# EAGLE design pic32 (EAGLE 5.12)
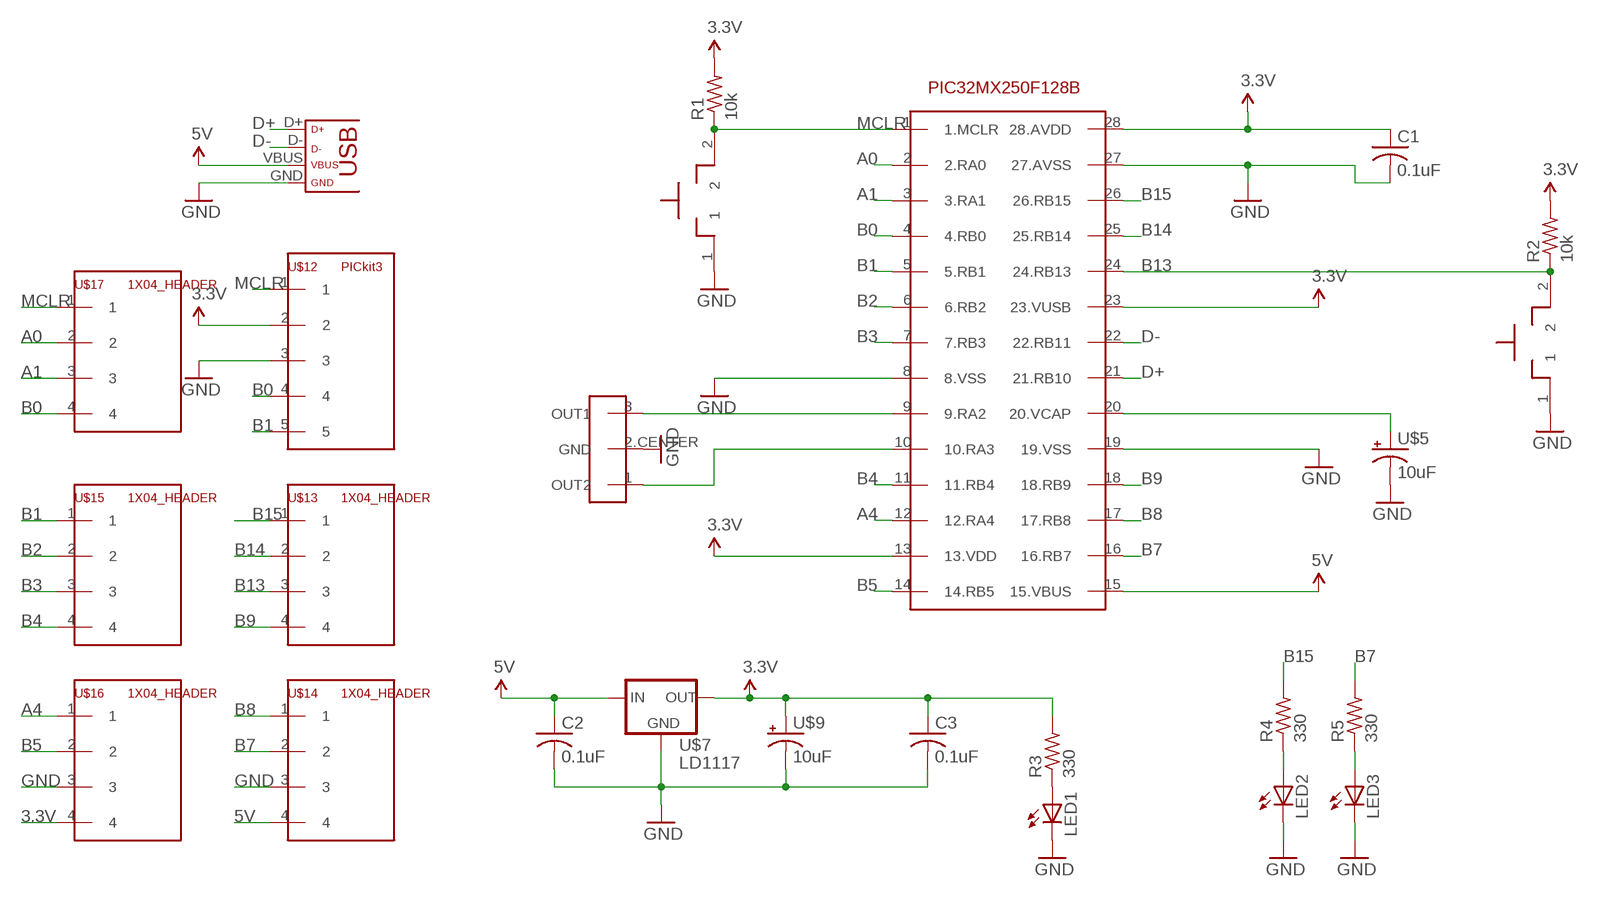
[diagram p0: schematic, sheet 1]

## Parts
8MHZ  RESONATORRESONATOR  [RESONATOR]
C1  0.1uF  C-US025-025X050  [C025-025X050]
C2  0.1uF  C-US025-025X050  [C025-025X050]
C3  0.1uF  C-US025-025X050  [C025-025X050]
CLEAR  BUTTONBUTTON  [0204/5]
LED1  LED3MM  [LED3MM]
LED2  LED3MM  [LED3MM]
LED3  LED3MM  [LED3MM]
R1  10k  R-US_0204/7  [0204/7]
R2  10k  R-US_0204/7  [0204/7]
R3  330  R-US_0204/7  [0204/7]
R4  330  R-US_0204/7  [0204/7]
R5  330  R-US_0204/7  [0204/7]
U$1  PIC32MX250F128B  PIC32DILPIC32MX250F128B  [DIL28-4]
U$5  10uF  CAP_POL  [CAP_POL_D]
U$7  LD1117  [TO220]
U$9  10uF  CAP_POL  [CAP_POL_D]
U$10  USB  [USB-MINIB]
U$12  PICkit3  1X05_HEADER  [1X05]
U$13  1X04_HEADER  [1X04]
U$14  1X04_HEADER  [1X04]
U$15  1X04_HEADER  [1X04]
U$16  1X04_HEADER  [1X04]
U$17  1X04_HEADER  [1X04]
USER  BUTTONBUTTON  [0204/5]

## Nets
3.3V: C1.1 C3.1 R1.2 R2.2 R3.2 U$1.13(13.VDD) U$1.23(23.VUSB) U$1.28(28.AVDD) U$7.2(OUT) U$9.1(+) U$12.2 U$16.4
5V: C2.1 U$1.15(15.VBUS) U$7.3(IN) U$10.VBUS U$14.4
A0: U$1.2(2.RA0) U$17.2
A1: U$1.3(3.RA1) U$17.3
A4: U$1.12(12.RA4) U$16.1
B0: U$1.4(4.RB0) U$12.4 U$17.4
B1: U$1.5(5.RB1) U$12.5 U$15.1
B2: U$1.6(6.RB2) U$15.2
B3: U$1.7(7.RB3) U$15.3
B4: U$1.11(11.RB4) U$15.4
B5: U$1.14(14.RB5) U$16.2
B7: R5.2 U$1.16(16.RB7) U$14.2
B8: U$1.17(17.RB8) U$14.1
B9: U$1.18(18.RB9) U$13.4
B13: R2.1 U$1.24(24.RB13) U$13.3 USER.2
B14: U$1.25(25.RB14) U$13.2
B15: R4.2 U$1.26(26.RB15) U$13.1
D+: U$1.21(21.RB10) U$10.D+
D-: U$1.22(22.RB11) U$10.D-
GND: 8MHZ.2.CENTER(GND) C1.2 C2.2 C3.2 CLEAR.1 LED1.K(C) LED2.K(C) LED3.K(C) U$1.8(8.VSS) U$1.19(19.VSS) U$1.27(27.AVSS) U$5.2(-) U$7.1(GND) U$9.2(-) U$10.GND U$12.3 U$14.3 U$16.3 USER.1
MCLR: CLEAR.2 R1.1 U$1.1(1.MCLR) U$12.1 U$17.1
N$2: 8MHZ.3(OUT1) U$1.9(9.RA2)
N$3: 8MHZ.1(OUT2) U$1.10(10.RA3)
N$4: U$1.20(20.VCAP) U$5.1(+)
N$8: LED1.A R3.1
N$9: LED2.A R4.1
N$10: LED3.A R5.1

## Library data of the parts
8MHZ = ME433:RESONATOR
C1-C3 = ME433:C-US: CAPACITOR, American symbol
CLEAR USER = ME433:BUTTON
LED1-LED3 = ME433:LED: LED OSRAM: - CHIPLED LG R971, LG N971, LY N971, LG Q971, LY Q971, LO R971, LY R971 LH N974, LH R974 LS Q976, LO Q976, LY Q976 LO Q996 - Hyper CHIPLED LW Q18S LB Q993, LB Q99A, LB R99A - SideLED LS A670, LO A670, LY A670, LG A670, LP A670 LB A673, LV A673, LT A673, LW A673 LH A674 LY A675 LS A676, LA A676, LO A676, LY A676, LW A676 LS A679, LY A679, LG A679 - Hyper Micro SIDELED® LS Y876, LA Y876, LO Y876, LY Y876 LT Y87S - SmartLED LW L88C, LW L88S LB L89C, LB L89S, LG L890 LS L89K, LO L89K, LY L89K LS L896, LA L896, LO L896, LY L896 - TOPLED LS T670, LO T670, LY T670, LG T670, LP T670 LSG T670, LSP T670, LSY T670, LOP T670, LYG T670 LG T671, LOG T671, LSG T671 LB T673, LV T673, LT T673, LW T673 LH T674 LS T676, LA T676, LO T676, LY T676, LB T676, LH T676, LSB T676, LW T676 LB T67C, LV T67C, LT T67C, LS T67K, LO T67K, LY T67K, LW E67C LS E67B, LA E67B, LO E67B, LY E67B, LB E67C, LV E67C, LT E67C LW T67C LS T679, LY T679, LG T679 LS T770, LO T770, LY T770, LG T770, LP T770 LB T773, LV T773, LT T773, LW T773 LH T774 LS E675, LA E675, LY E675, LS T675 LS T776, LA T776, LO T776, LY T776, LB T776 LHGB T686 LT T68C, LB T68C - Hyper Mini TOPLED® LB M676 - Mini TOPLED Santana® LG M470 LS M47K, LO M47K, LY M47K Source: http://www.osram.convergy.de LUXEON: - LUMILED® LXK2-PW12-R00, LXK2-PW12-S00, LXK2-PW14-U00, LXK2-PW14-V00 LXK2-PM12-R00, LXK2-PM12-S00, LXK2-PM14-U00 LXK2-PE12-Q00, LXK2-PE12-R00, LXK2-PE12-S00, LXK2-PE14-T00, LXK2-PE14-U00 LXK2-PB12-K00, LXK2-PB12-L00, LXK2-PB12-M00, LXK2-PB14-N00, LXK2-PB14-P00, LXK2-PB14-Q00 LXK2-PR12-L00, LXK2-PR12-M00, LXK2-PR14-Q00, LXK2-PR14-R00 LXK2-PD12-Q00, LXK2-PD12-R00, LXK2-PD12-S00 LXK2-PH12-R00, LXK2-PH12-S00 LXK2-PL12-P00, LXK2-PL12-Q00, LXK2-PL12-R00 Source: www.luxeon.com KINGBRIGHT: KA-3528ASYC Source: www.kingbright.com
R1-R5 = ME433:R-US_: RESISTOR, American symbol
U$1 = ME433:PIC32
U$5 U$9 = ME433:CAP_POL
U$7 = ME433:LD1117
U$10 = ME433:USB
U$12 = ME433:1X05_HEADER
U$13-U$17 = ME433:1X04_HEADER

## Board
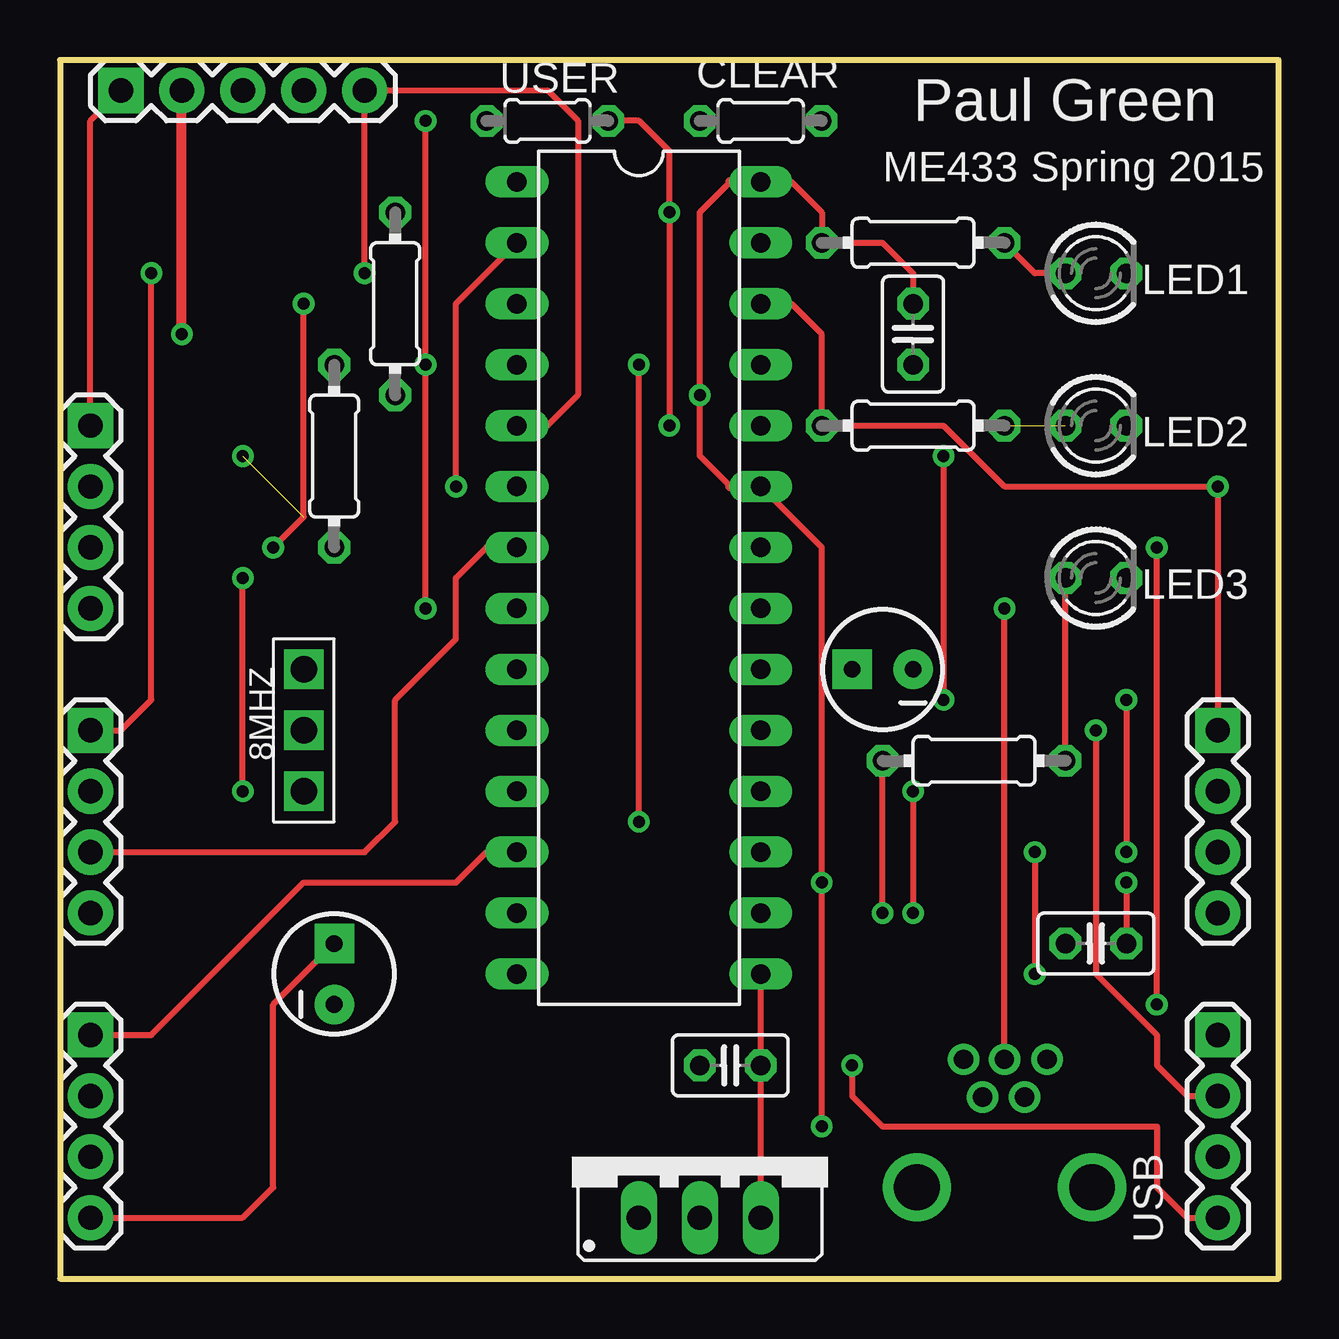
[diagram p1: board, top side]
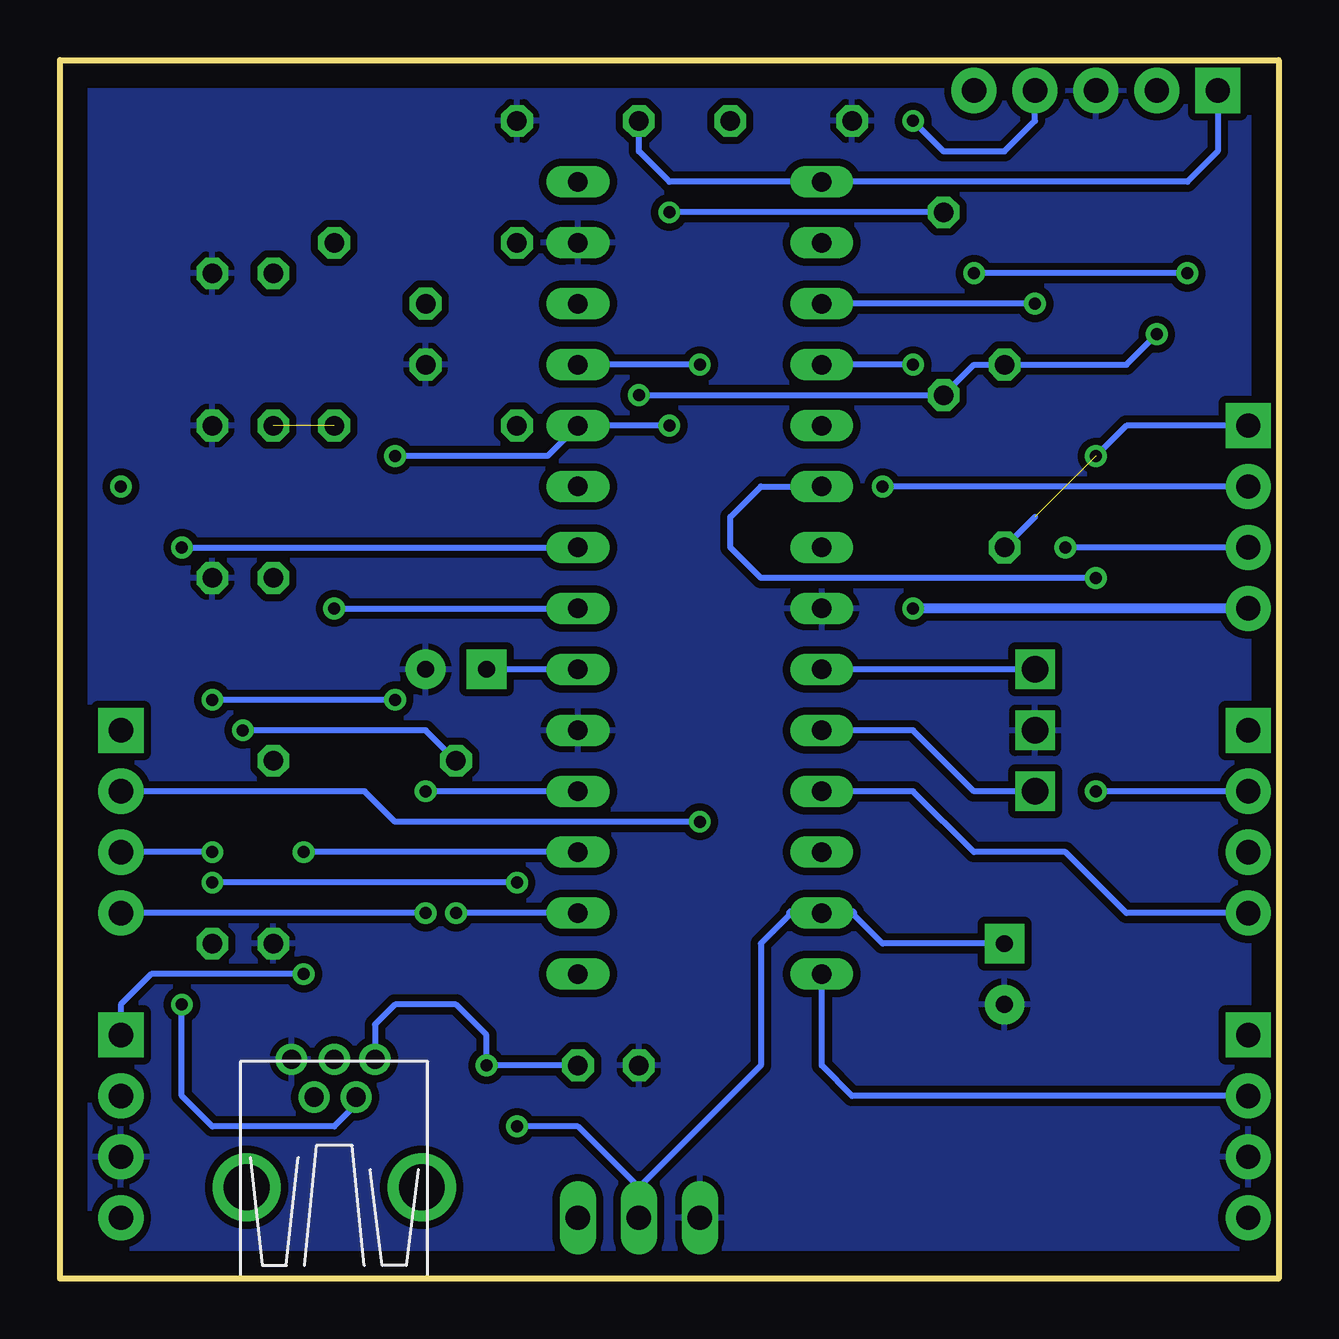
[diagram p2: board, bottom side, seen from below]

Size 50.8 x 50.8 mm. Coordinates in mm from the lower left corner, seen from the top.
Outline: 0,0 50.8,0 50.8,50.8 0,50.8 0,0
Copper layers (1*16): Top 0.035mm / dielectric 1.5mm / Bottom 0.035mm
Design rules "default": minimum track width 10mil, minimum drill 24mil, track to track 8mil, track to pad 8mil, pad to pad 8mil, via to via 8mil, smd to smd 8mil, copper to edge 40mil, drill to drill 8mil, minimum pad ring 10mil, minimum via ring 8mil, stop-mask expansion 4mil, vias tented up to drill 0mil, thermal gap 10mil

### Footprints (pad centres in the part's own frame; a part is rotated, then mirrored left to right if it is on the bottom)
RESONATOR = drill 1.1 square: 1 -2.54,0; 2.CENTER 0,0; 3 2.54,0
C025-025X050 = drill 0.813 octagon: 1 -1.27,0; 2 1.27,0
0204/5 = drill 0.813 octagon: 1 -2.54,0; 2 2.54,0
LED3MM = drill 0.813 octagon: A -1.27,0; K 1.27,0
0204/7 = drill 0.813 octagon: 1 -3.81,0; 2 3.81,0
DIL28-4 = drill 0.813 long: 1 -16.51,-5.08; 2 -13.97,-5.08; 3 -11.43,-5.08; 4 -8.89,-5.08; 5 -6.35,-5.08; 6 -3.81,-5.08; 7 -1.27,-5.08; 8 1.27,-5.08; 9 3.81,-5.08; 10 6.35,-5.08; 11 8.89,-5.08; 12 11.43,-5.08; 13 13.97,-5.08; 14 16.51,-5.08; 15 16.51,5.08; 16 13.97,5.08; 17 11.43,5.08; 18 8.89,5.08; 19 6.35,5.08; 20 3.81,5.08; 21 1.27,5.08; 22 -1.27,5.08; 23 -3.81,5.08; 24 -6.35,5.08; 25 -8.89,5.08; 26 -11.43,5.08; 27 -13.97,5.08; 28 -16.51,5.08
CAP_POL_D = drill 0.7 pad 1.651 square: 1 1.27,0 | drill 0.7 pad 1.651 round: 2 -1.27,0
TO220 = drill 1.016 long: 1 -2.54,0; 2 0,0; 3 2.54,0
USB-MINIB = drill 0.8 round: D+ 4.064,0; D- 2.489,0.914; GND 4.064,-1.778; ID 2.489,-0.838; VBUS 4.064,1.702 | drill 1.9 round: P$6 -1.27,-3.65; P$7 -1.27,3.65
1X05 = drill 1.016 pad 1.88 square: 1 0,0 | drill 1.016 pad 1.88 round: 2 2.54,0; 3 5.08,0; 4 7.62,0; 5 10.16,0
1X04 = drill 1.016 pad 1.88 square: 1 0,0 | drill 1.016 pad 1.88 round: 2 2.54,0; 3 5.08,0; 4 7.62,0

### Placement (x,y rotation side)
8MHZ  10.16,22.86 90 top
C1  35.56,39.37 270 top
C2  27.94,8.89 180 top
C3  43.18,13.97 180 top
CLEAR  29.21,48.26 180 top
LED1  43.18,41.91 0 top
LED2  43.18,35.56 0 top
LED3  43.18,29.21 0 top
R1  11.43,34.29 90 top
R2  13.97,40.64 270 top
R3  35.56,43.18 180 top
R4  35.56,35.56 180 top
R5  38.1,21.59 180 top
U$1  24.13,29.21 270 top
U$5  34.29,25.4 180 top
U$7  26.67,2.54 0 top
U$9  11.43,12.7 90 top
U$10  39.37,5.08 90 top
U$12  2.54,49.53 0 top
U$13  48.26,22.86 270 top
U$14  48.26,10.16 270 top
U$15  1.27,22.86 270 top
U$16  1.27,10.16 270 top
U$17  1.27,35.56 270 top
USER  20.32,48.26 0 top

### Tracks (layer width: path | path; a pad name or v marks a point on that pad's centre or on a via)
3.3V  (via drill 0.5)
  Top 0.254: v31.75,6.35 v31.75,16.51 31.75,30.48 U$1.23 | v44.45,16.51 C3.1 | U$1.28 30.48,45.72 31.75,44.45 R3.2 34.29,43.18 35.56,41.91 C1.1 | U$16.4 7.62,2.54 8.89,3.81 8.89,11.43 U$9.1 | 27.94,33.02 26.67,34.29 v26.67,36.83 26.67,44.45 27.94,45.72
  Top 0.406: v5.08,39.37 U$12.2 | U$1.23 27.94,33.02 | 27.94,45.72 U$1.28
  Bottom 0.254: v31.75,16.51 v44.45,16.51 | v26.67,36.83 R2.2 12.7,38.1 R1.2 6.35,38.1 v5.08,39.37 | 20.32,15.24 21.59,13.97 21.59,8.89 26.67,3.81 | 17.78,15.24 16.51,13.97 U$9.1 | 26.67,3.81 U$7.2 | 26.67,3.81 29.21,6.35 v31.75,6.35
  Bottom 0.406: 20.32,15.24 U$1.13 17.78,15.24
5V  (via drill 0.5)
  Top 0.254: U$7.3 C2.1 U$1.15 | U$14.4 46.99,2.54 45.72,3.81 45.72,6.35 34.29,6.35 33.02,7.62 v33.02,8.89
  Bottom 0.254: C2.1 v33.02,8.89 33.02,10.16 34.29,11.43 36.83,11.43 37.67,10.59 U$10.VBUS
A0  (via drill 0.5)
  Top 0.254: v16.51,33.02 16.51,40.64 U$1.2
  Bottom 0.254: U$17.2 v16.51,33.02
A1  (via drill 0.5)
  Top 0.254: v8.89,30.48 10.16,31.75 v10.16,40.64
  Bottom 0.254: U$17.3 v8.89,30.48 | v10.16,40.64 U$1.3
A4
  Top 0.254: U$16.1 3.81,10.16 10.16,16.51 16.51,16.51 17.78,17.78 U$1.12
B0  (via drill 0.5)
  Top 0.254: v15.24,27.94 v15.24,38.1 v15.24,48.26
  Bottom 0.254: v15.24,38.1 U$1.4 | U$12.4 10.16,48.26 11.43,46.99 13.97,46.99 v15.24,48.26
  Bottom 0.406: U$17.4 v15.24,27.94
B1  (via drill 0.5)
  Top 0.254: U$1.5 20.32,35.56 21.59,36.83 21.59,48.26 20.32,49.53 U$12.5 v12.7,41.91 | v3.81,41.91 3.81,24.13 2.54,22.86 U$15.1
  Bottom 0.254: v3.81,41.91 v12.7,41.91
B2  (via drill 0.5)
  Top 0.254: v7.62,20.32 v7.62,29.21
  Bottom 0.254: U$15.2 v7.62,20.32 | v7.62,29.21 21.59,29.21 22.86,30.48 22.86,31.75 21.59,33.02 U$1.6
B3
  Top 0.254: U$15.3 12.7,17.78 13.97,19.05 13.97,24.13 16.51,26.67 16.51,29.21 17.78,30.48 U$1.7
B4
  Bottom 0.254: U$15.4 6.35,15.24 8.89,17.78 12.7,17.78 15.24,20.32 U$1.11
B5
  Bottom 0.254: U$16.2 17.78,7.62 19.05,8.89 U$1.14
B7  (via drill 0.5)
  Top 0.254: v34.29,15.24 R5.2 | U$14.2 46.99,7.62 45.72,8.89 45.72,10.16 43.18,12.7 v43.18,22.86
  Bottom 0.254: U$1.16 v34.29,15.24 | R5.2 35.56,22.86 v43.18,22.86
B8  (via drill 0.5)
  Top 0.254: v40.64,17.78 v40.64,12.7
  Bottom 0.254: U$1.17 v40.64,17.78 | U$14.1 48.26,11.43 46.99,12.7 v40.64,12.7
B9  (via drill 0.5)
  Top 0.254: v35.56,20.32 v35.56,15.24
  Bottom 0.254: v35.56,15.24 U$13.4 | U$1.18 v35.56,20.32
B13  (via drill 0.5)
  Top 0.254: v25.4,35.56 v25.4,44.45 25.4,46.99 24.13,48.26 USER.2 | v44.45,24.13 v44.45,17.78 | v36.83,34.29 v36.83,24.13
  Bottom 0.254: v25.4,35.56 U$1.24 30.48,34.29 v36.83,34.29 | R2.1 v25.4,44.45 | v44.45,17.78 U$13.3 | v36.83,24.13 v44.45,24.13
B14  (via drill 0.5)
  Top 0.254: v24.13,19.05 v24.13,38.1
  Bottom 0.254: U$13.2 38.1,20.32 36.83,19.05 v24.13,19.05 | v24.13,38.1 U$1.25
B15  (via drill 0.5)
  Top 0.254: U$1.26 30.48,40.64 31.75,39.37 R4.2 34.29,35.56 36.83,35.56 39.37,33.02 v48.26,33.02 U$13.1
D+  (via drill 0.5)
  Top 0.254: U$10.D+ v39.37,27.94
  Bottom 0.254: v39.37,27.94 U$1.21
D-  (via drill 0.5)
  Top 0.254: v45.72,11.43 v45.72,30.48
  Bottom 0.254: v45.72,30.48 U$1.22 | v45.72,11.43 45.72,7.62 44.45,6.35 39.37,6.35 38.46,7.26 U$10.D-
GND
  pour Bottom (isolate 0.305): 0,0 50.8,0 50.8,50.8 0,50.8 0,49.53
MCLR  (via drill 0.5)  (1 unrouted)
  Top 0.254: U$17.1 1.27,48.26 U$12.1
  Bottom 0.254: R1.1 10.16,31.75 | U$17.1 6.35,35.56 v7.62,34.29 | U$12.1 2.54,46.99 3.81,45.72 U$1.1 25.4,45.72 26.67,46.99 CLEAR.2
N$2
  Bottom 0.254: 8MHZ.3 U$1.9
N$3
  Bottom 0.254: 8MHZ.1 12.7,20.32 15.24,22.86 U$1.10
N$4
  Bottom 0.254: U$1.20 U$5.1
N$8
  Top 0.254: R3.1 40.64,41.91 LED1.A
N$9  (1 unrouted)
N$10
  Top 0.254: R5.1 LED3.A

### Text on the board
tPlace: Paul Green | ME433 Spring 2015